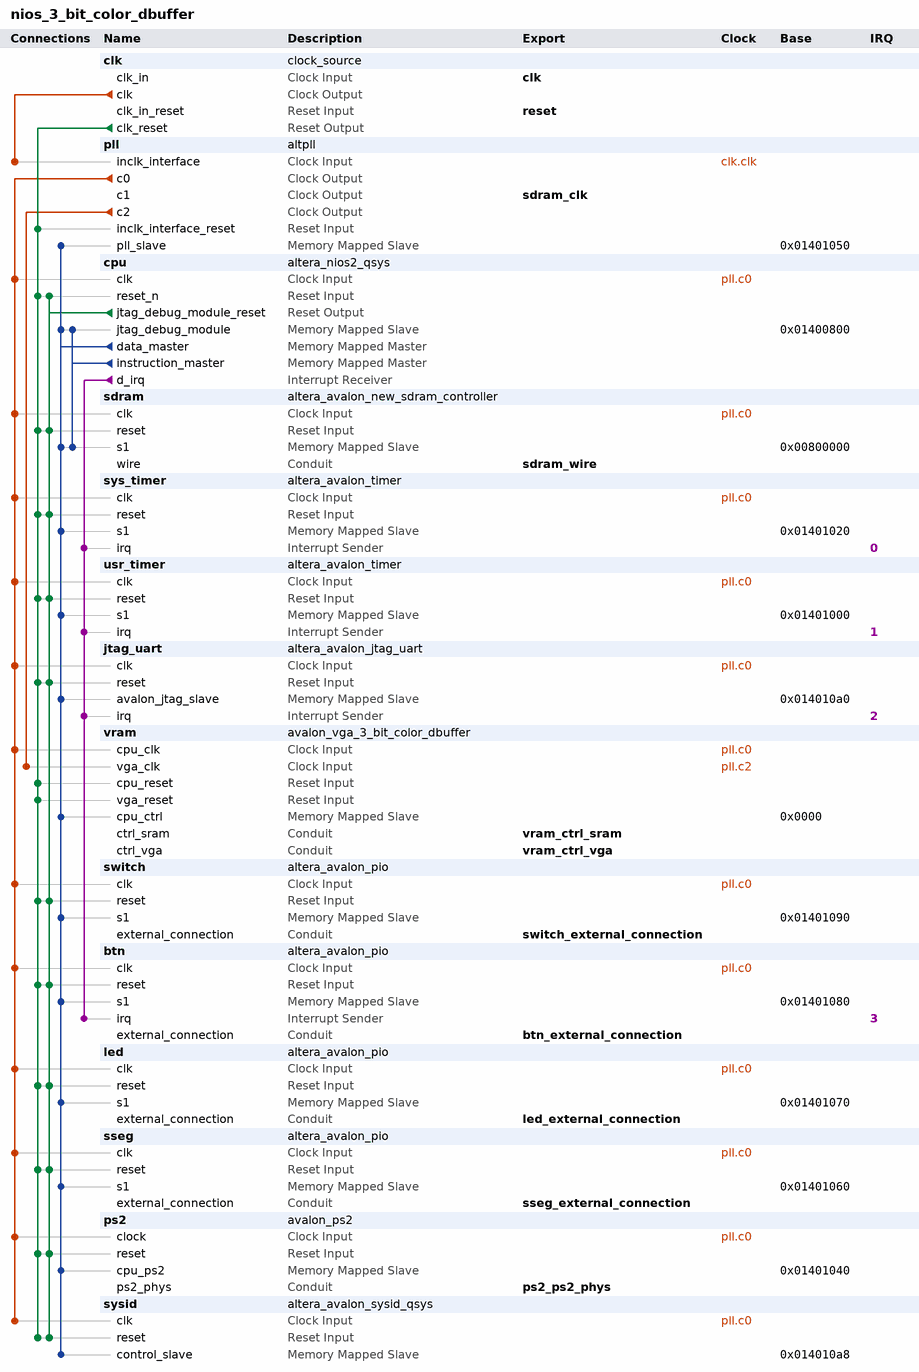
[diagram p0: system contents]
# Platform Designer (Qsys) system nios_3_bit_color_dbuffer, Cyclone IV GX Unknown
# Parameters at their usual value, and those the tool derives, are not listed.
package require -exact qsys 13.0.1.99.2
create_system nios_3_bit_color_dbuffer
set_project_property DEVICE_FAMILY {Cyclone IV GX}
set_project_property DEVICE Unknown

add_instance clk clock_source 13.0
set_instance_parameter_value clk clockFrequency 50000000

add_instance pll altpll 13.0
set_instance_parameter_value pll INCLK0_INPUT_FREQUENCY 20000
set_instance_parameter_value pll CLK0_MULTIPLY_BY 1
set_instance_parameter_value pll CLK1_MULTIPLY_BY 1
set_instance_parameter_value pll CLK2_MULTIPLY_BY 1
set_instance_parameter_value pll CLK0_DIVIDE_BY 1
set_instance_parameter_value pll CLK1_DIVIDE_BY 1
set_instance_parameter_value pll CLK2_DIVIDE_BY 2
set_instance_parameter_value pll CLK1_PHASE_SHIFT -3000
set_instance_parameter_value pll CLK2_PHASE_SHIFT 0
set_instance_parameter_value pll CLK1_DUTY_CYCLE 50
set_instance_parameter_value pll CLK2_DUTY_CYCLE 50
set_instance_parameter_value pll PORT_clk1 PORT_USED
set_instance_parameter_value pll PORT_clk2 PORT_USED
set_instance_parameter_value pll PORT_clk3 PORT_UNUSED
set_instance_parameter_value pll PORT_ARESET PORT_UNUSED
set_instance_parameter_value pll PORT_LOCKED PORT_UNUSED

add_instance cpu altera_nios2_qsys 13.0
set_instance_parameter_value cpu resetSlave sdram.s1
set_instance_parameter_value cpu mmu_TLBMissExcSlave None
set_instance_parameter_value cpu exceptionSlave sdram.s1
set_instance_parameter_value cpu breakSlave cpu.jtag_debug_module
set_instance_parameter_value cpu impl Fast
set_instance_parameter_value cpu icache_size 4096

add_instance sdram altera_avalon_new_sdram_controller 13.0.1.99.2
set_instance_parameter_value sdram TAC 6.0
set_instance_parameter_value sdram TRCD 20.0
set_instance_parameter_value sdram TRP 20.0
set_instance_parameter_value sdram casLatency 3
set_instance_parameter_value sdram columnWidth 8
set_instance_parameter_value sdram dataWidth 16
set_instance_parameter_value sdram generateSimulationModel false
set_instance_parameter_value sdram initRefreshCommands 8
set_instance_parameter_value sdram model single_Micron_MT48LC4M32B2_7_chip
set_instance_parameter_value sdram numberOfBanks 4
set_instance_parameter_value sdram numberOfChipSelects 1
set_instance_parameter_value sdram powerUpDelay 200.0
set_instance_parameter_value sdram refreshPeriod 15.625
set_instance_parameter_value sdram rowWidth 12

add_instance sys_timer altera_avalon_timer 13.0.1.99.2
set_instance_parameter_value sys_timer period 1
set_instance_parameter_value sys_timer periodUnits MSEC

add_instance usr_timer altera_avalon_timer 13.0.1.99.2
set_instance_parameter_value usr_timer period 1
set_instance_parameter_value usr_timer periodUnits MSEC

add_instance jtag_uart altera_avalon_jtag_uart 13.0.1.99.2
set_instance_parameter_value jtag_uart simInteractiveOptions NO_INTERACTIVE_WINDOWS

add_instance vram avalon_vga_3_bit_color_dbuffer 1.0

add_instance switch altera_avalon_pio 13.0.1.99.2
set_instance_parameter_value switch direction Input
set_instance_parameter_value switch width 10

add_instance btn altera_avalon_pio 13.0.1.99.2
set_instance_parameter_value btn captureEdge true
set_instance_parameter_value btn direction Input
set_instance_parameter_value btn generateIRQ true
set_instance_parameter_value btn irqType EDGE
set_instance_parameter_value btn width 4

add_instance led altera_avalon_pio 13.0.1.99.2
set_instance_parameter_value led direction Output
set_instance_parameter_value led width 18

add_instance sseg altera_avalon_pio 13.0.1.99.2
set_instance_parameter_value sseg direction Output
set_instance_parameter_value sseg width 32

add_instance ps2 avalon_ps2 1.0
set_instance_parameter_value ps2 W_SIZE 2

add_instance sysid altera_avalon_sysid_qsys 13.0
set_instance_parameter_value sysid id 0

# connections
add_connection clk.clk pll.inclk_interface clock
add_connection pll.c0 btn.clk clock
add_connection pll.c0 cpu.clk clock
add_connection pll.c0 jtag_uart.clk clock
add_connection pll.c0 led.clk clock
add_connection pll.c0 ps2.clock clock
add_connection pll.c0 sdram.clk clock
add_connection pll.c0 sseg.clk clock
add_connection pll.c0 switch.clk clock
add_connection pll.c0 sys_timer.clk clock
add_connection pll.c0 sysid.clk clock
add_connection pll.c0 usr_timer.clk clock
add_connection pll.c0 vram.cpu_clk clock
add_connection pll.c2 vram.vga_clk clock
add_connection clk.clk_reset btn.reset reset
add_connection clk.clk_reset cpu.reset_n reset
add_connection clk.clk_reset jtag_uart.reset reset
add_connection clk.clk_reset led.reset reset
add_connection clk.clk_reset pll.inclk_interface_reset reset
add_connection clk.clk_reset ps2.reset reset
add_connection clk.clk_reset sdram.reset reset
add_connection clk.clk_reset sseg.reset reset
add_connection clk.clk_reset switch.reset reset
add_connection clk.clk_reset sys_timer.reset reset
add_connection clk.clk_reset sysid.reset reset
add_connection clk.clk_reset usr_timer.reset reset
add_connection clk.clk_reset vram.cpu_reset reset
add_connection clk.clk_reset vram.vga_reset reset
add_connection cpu.jtag_debug_module_reset btn.reset reset
add_connection cpu.jtag_debug_module_reset cpu.reset_n reset
add_connection cpu.jtag_debug_module_reset jtag_uart.reset reset
add_connection cpu.jtag_debug_module_reset led.reset reset
add_connection cpu.jtag_debug_module_reset ps2.reset reset
add_connection cpu.jtag_debug_module_reset sdram.reset reset
add_connection cpu.jtag_debug_module_reset sseg.reset reset
add_connection cpu.jtag_debug_module_reset switch.reset reset
add_connection cpu.jtag_debug_module_reset sys_timer.reset reset
add_connection cpu.jtag_debug_module_reset sysid.reset reset
add_connection cpu.jtag_debug_module_reset usr_timer.reset reset
add_connection cpu.data_master btn.s1 avalon
set_connection_parameter_value cpu.data_master/btn.s1 baseAddress 0x01401080
add_connection cpu.data_master cpu.jtag_debug_module avalon
set_connection_parameter_value cpu.data_master/cpu.jtag_debug_module baseAddress 0x01400800
add_connection cpu.data_master jtag_uart.avalon_jtag_slave avalon
set_connection_parameter_value cpu.data_master/jtag_uart.avalon_jtag_slave baseAddress 0x014010a0
add_connection cpu.data_master led.s1 avalon
set_connection_parameter_value cpu.data_master/led.s1 baseAddress 0x01401070
add_connection cpu.data_master pll.pll_slave avalon
set_connection_parameter_value cpu.data_master/pll.pll_slave baseAddress 0x01401050
add_connection cpu.data_master ps2.cpu_ps2 avalon
set_connection_parameter_value cpu.data_master/ps2.cpu_ps2 baseAddress 0x01401040
add_connection cpu.data_master sdram.s1 avalon
set_connection_parameter_value cpu.data_master/sdram.s1 baseAddress 0x00800000
add_connection cpu.data_master sseg.s1 avalon
set_connection_parameter_value cpu.data_master/sseg.s1 baseAddress 0x01401060
add_connection cpu.data_master switch.s1 avalon
set_connection_parameter_value cpu.data_master/switch.s1 baseAddress 0x01401090
add_connection cpu.data_master sys_timer.s1 avalon
set_connection_parameter_value cpu.data_master/sys_timer.s1 baseAddress 0x01401020
add_connection cpu.data_master sysid.control_slave avalon
set_connection_parameter_value cpu.data_master/sysid.control_slave baseAddress 0x014010a8
add_connection cpu.data_master usr_timer.s1 avalon
set_connection_parameter_value cpu.data_master/usr_timer.s1 baseAddress 0x01401000
add_connection cpu.data_master vram.cpu_ctrl avalon
set_connection_parameter_value cpu.data_master/vram.cpu_ctrl baseAddress 0x0000
add_connection cpu.instruction_master cpu.jtag_debug_module avalon
set_connection_parameter_value cpu.instruction_master/cpu.jtag_debug_module baseAddress 0x01400800
add_connection cpu.instruction_master sdram.s1 avalon
set_connection_parameter_value cpu.instruction_master/sdram.s1 baseAddress 0x00800000
add_connection cpu.d_irq btn.irq interrupt
set_connection_parameter_value cpu.d_irq/btn.irq irqNumber 3
add_connection cpu.d_irq jtag_uart.irq interrupt
set_connection_parameter_value cpu.d_irq/jtag_uart.irq irqNumber 2
add_connection cpu.d_irq sys_timer.irq interrupt
set_connection_parameter_value cpu.d_irq/sys_timer.irq irqNumber 0
add_connection cpu.d_irq usr_timer.irq interrupt
set_connection_parameter_value cpu.d_irq/usr_timer.irq irqNumber 1

# exported interfaces
add_interface clk clock sink
set_interface_property clk EXPORT_OF clk.clk_in
add_interface reset reset sink
set_interface_property reset EXPORT_OF clk.clk_in_reset
add_interface switch_external_connection conduit end
set_interface_property switch_external_connection EXPORT_OF switch.external_connection
add_interface btn_external_connection conduit end
set_interface_property btn_external_connection EXPORT_OF btn.external_connection
add_interface led_external_connection conduit end
set_interface_property led_external_connection EXPORT_OF led.external_connection
add_interface sseg_external_connection conduit end
set_interface_property sseg_external_connection EXPORT_OF sseg.external_connection
add_interface sdram_wire conduit end
set_interface_property sdram_wire EXPORT_OF sdram.wire
add_interface sdram_clk clock source
set_interface_property sdram_clk EXPORT_OF pll.c1
add_interface ps2_ps2_phys conduit end
set_interface_property ps2_ps2_phys EXPORT_OF ps2.ps2_phys
add_interface vram_ctrl_vga conduit end
set_interface_property vram_ctrl_vga EXPORT_OF vram.ctrl_vga
add_interface vram_ctrl_sram conduit end
set_interface_property vram_ctrl_sram EXPORT_OF vram.ctrl_sram

set_interconnect_requirement {$system} qsys_mm.clockCrossingAdapter HANDSHAKE
set_interconnect_requirement {$system} qsys_mm.maxAdditionalLatency 1

save_system nios_3_bit_color_dbuffer.qsys
